# Altium schematic sheet Tube.SchDoc
size B; Organization: Altium Limited; Address1: L3, 12a Rodborough Rd; Address2: Frenchs Forest; Address3: NSW; Address4: Australia 2086
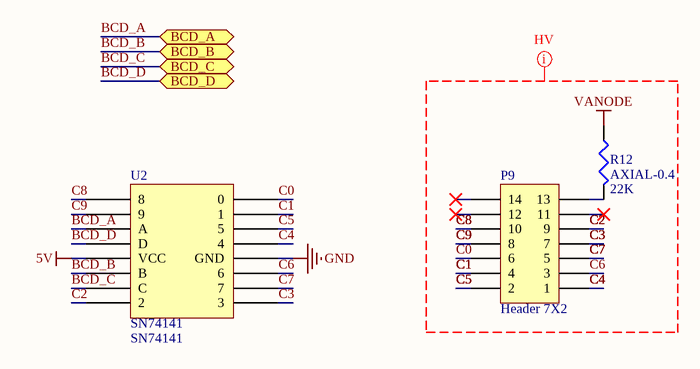
[diagram p0: Tube.SchDoc]

## Parts
P9  Header 7X2  [HDR2X7]
R12  AXIAL-0.4  value 22K  [AXIAL-0.4]
U2  SN74141  [DIP-16]

## Ports
BCD_A, BCD_B, BCD_C, BCD_D

## Nets
5V: U2.5(VCC)
GND: U2.12(GND)
VANODE: R12.1
BCD_A: U2.3(A) ; port BCD_A
BCD_B: U2.6(B) ; port BCD_B
BCD_C: U2.7(C) ; port BCD_C
BCD_D: U2.4(D) ; port BCD_D
C0: P9.6 U2.16(0)
C1: P9.4 U2.15(1)
C2: P9.9 U2.8(2)
C3: P9.7 U2.9(3)
C4: P9.1 U2.13(4)
C5: P9.2 U2.14(5)
C6: P9.3 U2.11(6)
C7: P9.5 U2.10(7)
C8: P9.10 U2.1(8)
C9: P9.8 U2.2(9)
NetP9_13: P9.13 R12.2

Not connected (* = marked no-connect by the designer): P9 11* 12* 14*

## Layout directives
net class HV: C0, C1, C2, C3, C4, C5, C6, C7, C8, C9, VANODE

## Notes on the sheet
- Title
- Size:
- Date:
- B
- Number:
- Time:
- Revision:
- Sheet
- of
- File:

## Library data of the parts
P9 = Header 7X2: Header, 7-Pin, Dual row; LatestRevisionDate: 17-Jul-2002; LatestRevisionNote: Re-released for DXP Platform.; Publisher: Altium Limited
R12 = Res3: Resistor; Published: 8-Jun-2000; LatestRevisionDate: 29-May-2009; LatestRevisionNote: IPC-7351 Footprint Added.; PackageReference: AXIAL-0.4; Publisher: Altium Limited; PackageDescription: Chip Resistor
U2 = BCD-to-Decimal Driver: PartNumber: SN74141